# Altium schematic sheet USB.SchDoc
size A4
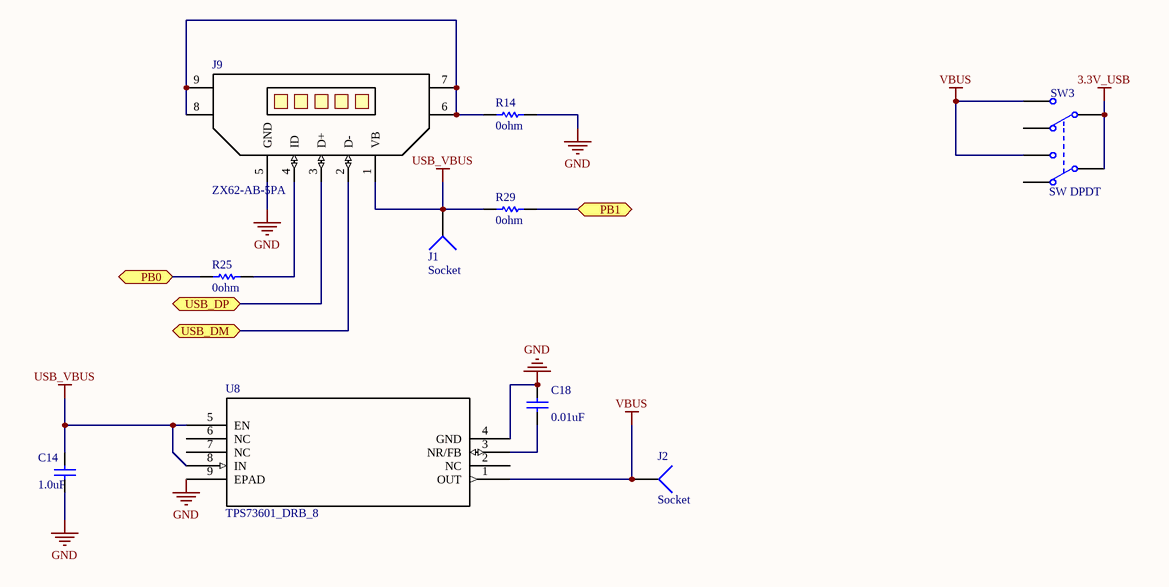
[diagram p0: USB.SchDoc]

## Parts
C14  1.0uF  [C0805]
C18  0.01uF  [C0805]
J1  Socket  [PIN1]
J2  Socket  [PIN1]
J9  ZX62-AB-5PA  [ZX62-AB-5PA]
R14  0ohm  [ERA-0805]
R25  0ohm  [ERA-0805]
R29  0ohm  [ERA-0805]
SW3  SW DPDT  [JS202011SCQN]
U8  TPS73601_DRB_8  [DRB8_1P75X1P5]

## Ports
PB0 (bidir), PB1 (bidir), USB_DM (bidir), USB_DP (bidir)

## Nets
3.3V_USB: SW3.1(COMMON1) SW3.5(COMMON2)
GND: C14.1 C18.2 J9.5(GND) R14.2 U8.4(GND) U8.9(EPAD)
USB_VBUS: C14.2 J1.1 J9.1(VB) R29.1 U8.5(EN) U8.8(IN)
VBUS: J2.1 SW3.3(NO1) SW3.6(NO2) U8.1(OUT)
PB0: R25.1 ; port PB0
PB1: R29.2 ; port PB1
USB_DM: J9.2(D-) ; port USB_DM
USB_DP: J9.3(D+) ; port USB_DP
NetC18_1: C18.1 U8.3(NR/FB)
NetJ9_4: J9.4(ID) R25.2
NetJ9_6: J9.6 J9.7 J9.8 J9.9 R14.1

Not connected (* = marked no-connect by the designer): SW3 2(NC1) 4(NC2); U8 2(NC) 6(NC) 7(NC)

## Library data of the parts
C14 C18 = Cap Semi: Capacitor (Semiconductor SIM Model); Published: 8-Jun-2000; LatestRevisionDate: 29-May-2009; LatestRevisionNote: IPC-7351 Footprint Added.; PackageReference: C1206; Publisher: Altium Limited; PackageDescription: Chip Capacitor
  C14: Value: 1.0uF
  C18: Value: 0.01uF
R14 R25 R29 = ERAS: Metal Film Thermosensitive Chip Resistor, 0.56 Ohm to 10k Ohm Range, 5% Tolerance, 0805 Size, 0.1 W; Note: If flow soldering, adjust pad width of PCB Footprint to 0.7 - 0.8 times the width of the resistor.; Published: 17-Dec-2003; LatestRevisionDate: 19-Mar-2004; LatestRevisionNote: Silkscreen size reduced.; PackageReference: ERA-0805; Publisher: Altium Limited; PackageDocument: Mar-2003; Code_IPC: 2012 [0805]; ComponentLink1Description: Manufacturer Link; ComponentLink1URL: http://www.panasonic.com/industrial/components/resistive_products.htm; ComponentLink2Description: Datasheet; ComponentLink2URL: http://www.panasonic.com/industrial/components/pdf/AOF0000CE1.pdf
SW3 = SW DPDT: Switch; Published: 24-Mar-1999; LatestRevisionDate: 29-May-2009; LatestRevisionNote: IPC-7351 Footprint Added.; PackageVersion: Mar-2001; PackageReference: SOT23-6; Publisher: Altium Limited; PackageDescription: 6-Pin SOT-23 Package 0.95 mm Pitch, 2.7 mm Lead Span; Code_JEITA: SC-74; Code_IPC: SOT26A-6
U8 = TPS73601_DRB_8: Imported; Vendor: Texas Instruments; PACKAGE_DESIGNATOR: DRB; PIN_COUNT: 8; FAMILY_NAME: SINGLE CHANNEL LDO; INDUSTRY_STD_PKG_TYPE: SON; Manufacturer_Part_Number: tps73601_drb_8; GENERIC_PART_NUMBER: TPS73601; Datasheet URL: http://www.ti.com/lit/gpn/TPS73601; Manufacturer: Texas Instruments; RefDes: RefDes; Type: DEV; Value: Value
J1 J2 = Socket: LatestRevisionDate: 17-Jul-2002; LatestRevisionNote: Re-released for DXP Platform.; Publisher: Altium Limited